# Altium project AD603.PrjPCB
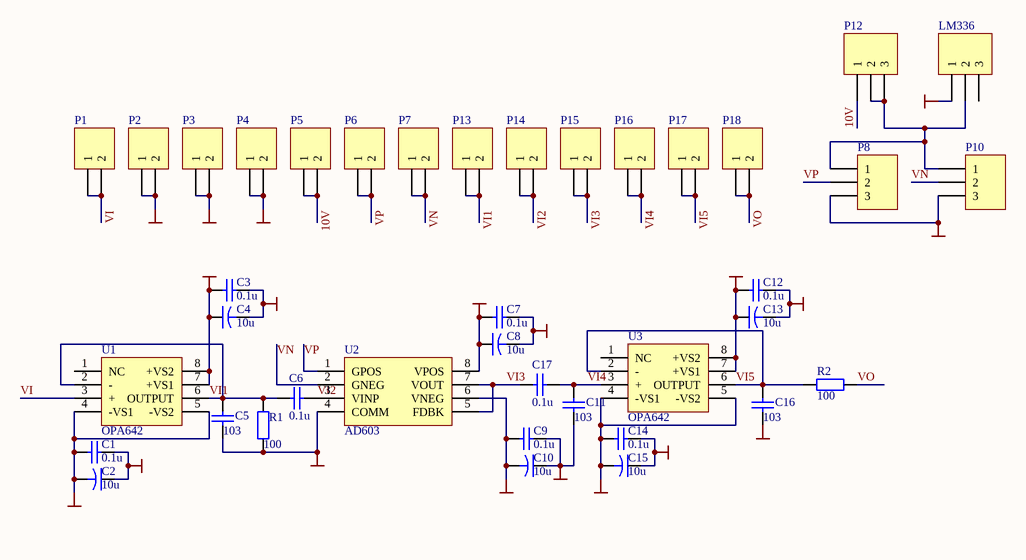
[diagram p0: AD603.SchDoc]
2 sheets, 97 parts. Net scope: global (net labels, ports and power ports of the same name join across sheets).
Board file: AD603.PcbDoc
Sheets:
  AD603.SchDoc
  TLC5510.SchDoc

## Sheet AD603.SchDoc
size A4

### Parts
(Parts that share a designator on the sheet are numbered #1, #2 ... from top to bottom, then left to right.)
C1#1  value 0.1u  [CC2012-0805]
C2#1  value 10u  [CR3225-1210]
C3#1  value 0.1u  [CR3225-1210]
C4#1  value 10u  [CC2012-0805]
C5#1  value 103  [CC2012-0805]
C6#1  value 0.1u  [CC2012-0805]
C7#1  value 0.1u  [CR3225-1210]
C8#1  value 10u  [CC2012-0805]
C9#1  value 0.1u  [CR3225-1210]
C10#1  value 10u  [CC2012-0805]
C11#1  value 103  [CC2012-0805]
C12#1  value 0.1u  [CC3216-1206]
C13#1  value 10u  [CC2012-0805]
C14#1  value 0.1u  [CC2012-0805]
C15#1  value 10u  [CR3225-1210]
C16#1  value 103  [CC2012-0805]
C17#1  value 0.1u  [CC2012-0805]
LM336#1  (no value)  [HDR1X3]
P1  (no value)  [HDR1X2]
P2  (no value)  [HDR1X2]
P3  (no value)  [HDR1X2]
P4  (no value)  [HDR1X2]
P5  (no value)  [HDR1X2]
P6  (no value)  [HDR1X2]
P7  (no value)  [HDR1X2]
P8  (no value)  [HDR1X3]
P10  (no value)  [HDR1X3]
P12  (no value)  [HDR1X3]
P13  (no value)  [HDR1X2]
P14  (no value)  [HDR1X2]
P15  (no value)  [HDR1X2]
P16  (no value)  [HDR1X2]
P17  (no value)  [HDR1X2]
P18  (no value)  [HDR1X2]
R1#1  value 100  [CC3216-1206]
R2#1  value 100  [CC3216-1206]
U1#1  OPA642  [DIP-8]
U2#1  AD603  [SO-8]
U3#1  OPA642  [DIP-8]

### Nets
GND: C1#1.1 C2#1.1 C3#1.2 C4#1.2 C5#1.1 C7#1.2 C8#1.2 C9#1.1 C10#1.1 C11#1.1 C12#1.2 C13#1.2 C14#1.1 C15#1.1 C16#1.1 LM336#1.1 P4.1 P4.2 P8.3 P10.3 R1#1.2 U2#1.4(COMM)
VCC: C3#1.1 C4#1.1 C7#1.1 C8#1.1 C12#1.1 C13#1.1 P3.1 P3.2 U1#1.7(+VS1) U1#1.8(+VS2) U2#1.8(VPOS) U3#1.7(+VS1) U3#1.8(+VS2)
VEE: C1#1.2 C2#1.2 C9#1.2 C10#1.2 C14#1.2 C15#1.2 P2.1 P2.2 U1#1.4(-VS1) U1#1.5(-VS2) U2#1.6(VNEG) U3#1.4(-VS1) U3#1.5(-VS2)
10V: P5.1 P5.2 P12.1
VI: P1.1 P1.2 U1#1.3(+)
VI1: C5#1.2 C6#1.1 P13.1 P13.2 R1#1.1 U1#1.2(-) U1#1.6(OUTPUT)
VI2: C6#1.2 P14.1 P14.2 U2#1.3(VINP)
VI3: C17#1.1 P15.1 P15.2 U2#1.5(FDBK) U2#1.7(VOUT)
VI4: C11#1.2 C17#1.2 P16.1 P16.2 U3#1.3(+)
VI5: C16#1.2 P17.1 P17.2 R2#1.1 U3#1.2(-) U3#1.6(OUTPUT)
VN: P7.1 P7.2 P10.2 U2#1.2(GNEG)
VO: P18.1 P18.2 R2#1.2
VP: P6.1 P6.2 P8.2 U2#1.1(GPOS)
NetLM336#1_2: LM336#1.2 P8.1 P10.1 P12.2 P12.3

Not connected (* = marked no-connect by the designer): LM336#1 3; U1#1 1(NC); U3#1 1(NC)

### Library data of the parts
C1#1 C3#1 C6#1 C7#1 C9#1 C12#1 C14#1 C17#1 = Cap Semi: Capacitor (Semiconductor SIM Model); Published: 8-Jun-2000; LatestRevisionDate: 17-Jul-2002; LatestRevisionNote: Re-released for DXP Platform.; PackageReference: C1206; Publisher: Altium Limited
C2#1 C4#1 C8#1 C10#1 C13#1 C15#1 = Cap2: Capacitor; Published: 23-Sep-2002; Publisher: Altium Limited
C5#1 C11#1 C16#1 = Cap: Capacitor; Published: 8-Jun-2000; LatestRevisionDate: 17-Jul-2002; LatestRevisionNote: Re-released for DXP Platform.; Publisher: Altium Limited
LM336#1 P8 P10 P12 = Header 3: Header, 3-Pin; LatestRevisionDate: 17-Jul-2002; LatestRevisionNote: Re-released for DXP Platform.; Publisher: Altium Limited
P1-P7 = Header 2: Header, 2-Pin; LatestRevisionDate: 17-Jul-2002; LatestRevisionNote: Re-released for DXP Platform.; Publisher: Altium Limited
P13-P18 = Header 2H: Header, 2-Pin, Right Angle; LatestRevisionDate: 17-Jul-2002; LatestRevisionNote: Re-released for DXP Platform.; Publisher: Altium Limited
R1#1 R2#1 = Res2: Resistor; Published: 8-Jun-2000; LatestRevisionDate: 17-Jul-2002; LatestRevisionNote: Re-released for DXP Platform.; Publisher: Altium Limited

## Sheet TLC5510.SchDoc
size A4
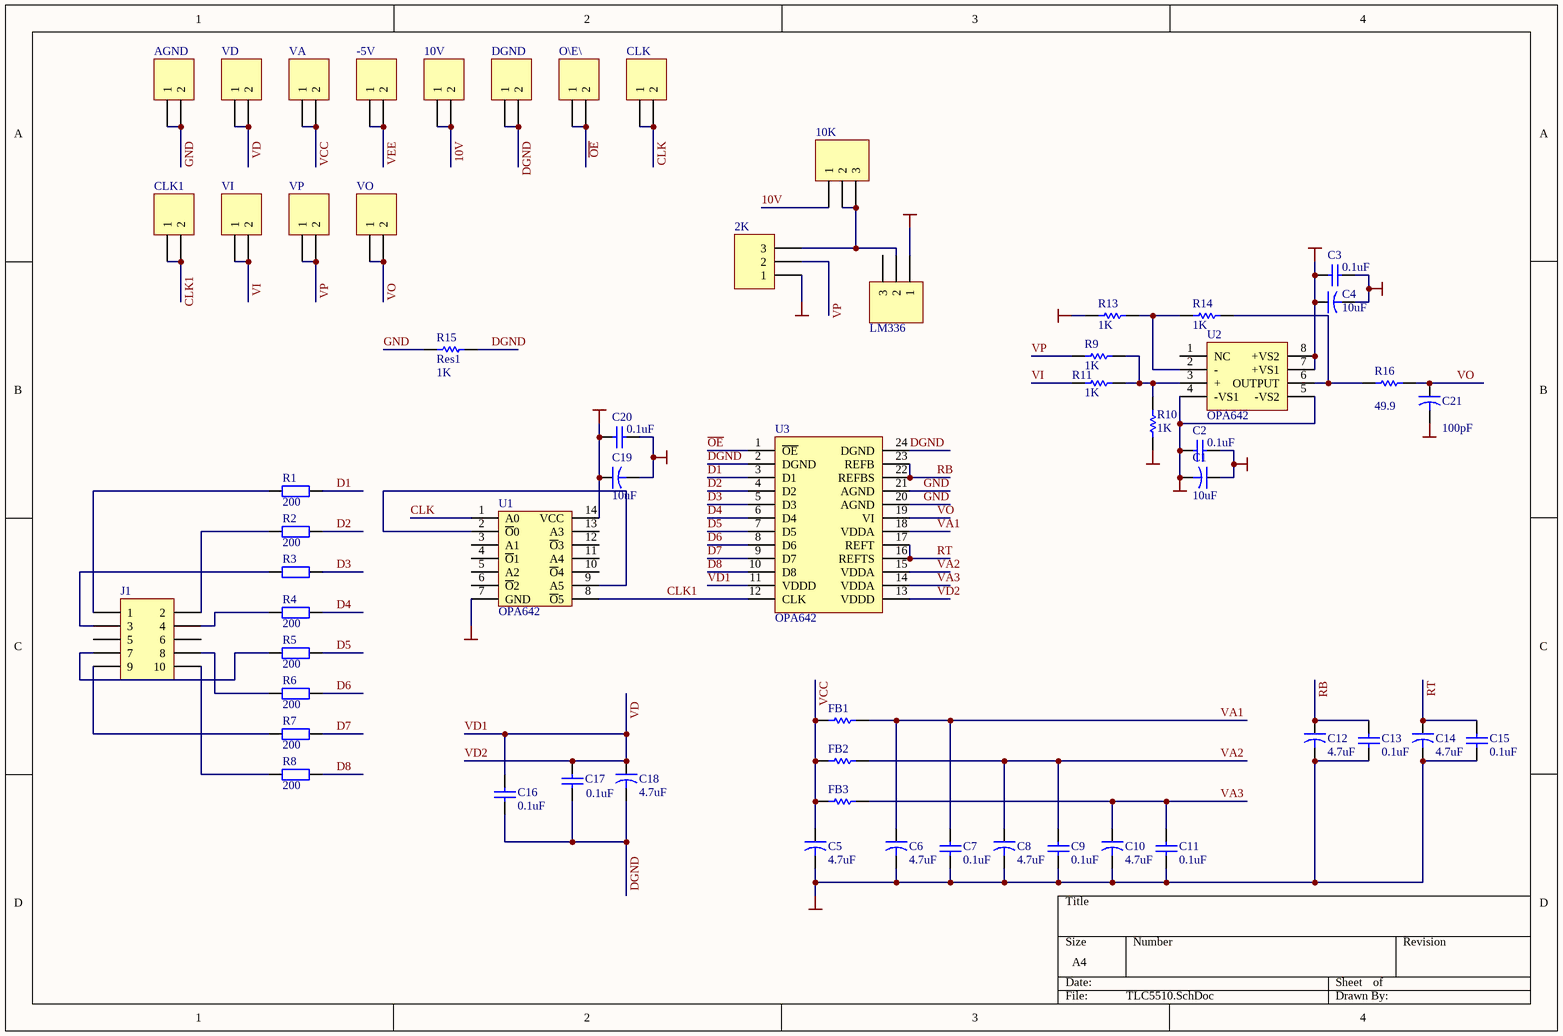
[diagram p1: TLC5510.SchDoc]

### Parts
(Parts that share a designator on the sheet are numbered #1, #2 ... from top to bottom, then left to right.)
2K  (no value)  [HDR1X3]
10K  (no value)  [HDR1X3]
10V  (no value)  [HDR1X2]
-5V  (no value)  [HDR1X2]
AGND  (no value)  [HDR1X2]
C1#2  value 10uF  [CR3225-1210]
C2#2  value 0.1uF  [CC2012-0805]
C3#2  value 0.1uF  [CC2012-0805]
C4#2  value 10uF  [CR3225-1210]
C5#2  value 4.7uF  [CR3225-1210]
C6#2  value 4.7uF  [CR3225-1210]
C7#2  value 0.1uF  [CC2012-0805]
C8#2  value 4.7uF  [CR3225-1210]
C9#2  value 0.1uF  [CC2012-0805]
C10#2  value 4.7uF  [CR3225-1210]
C11#2  value 0.1uF  [CC2012-0805]
C12#2  value 4.7uF  [CR3225-1210]
C13#2  value 0.1uF  [CC2012-0805]
C14#2  value 4.7uF  [CR3225-1210]
C15#2  value 0.1uF  [CC2012-0805]
C16#2  value 0.1uF  [CC2012-0805]
C17#2  value 0.1uF  [CC2012-0805]
C18  value 4.7uF  [CR3225-1210]
C19  value 10uF  [CR3225-1210]
C20  value 0.1uF  [CC2012-0805]
C21  value 100pF  [CR3216-1206]
CLK  (no value)  [HDR1X2]
CLK1  (no value)  [HDR1X2]
DGND  (no value)  [HDR1X2]
FB1  (no value)  [CC2012-0805]
FB2  (no value)  [CC2012-0805]
FB3  (no value)  [CC2012-0805]
J1  (no value)  [HDR2X5]
LM336#2  (no value)  [HDR1X3]
O\E\  (no value)  [HDR1X2]
R1#2  value 200  [CC2012-0805]
R2#2  value 200  [CC2012-0805]
R3  (no value)  [CC2012-0805]
R4  value 200  [CC2012-0805]
R5  value 200  [CC2012-0805]
R6  value 200  [CR2012-0805]
R7  value 200  [CC2012-0805]
R8  value 200  [CC2012-0805]
R9  value 1K  [AXIAL-0.3]  (hidden comment: Res1)
R10  value 1K  [AXIAL-0.3]  (hidden comment: Res1)
R11  value 1K  [AXIAL-0.3]  (hidden comment: Res1)
R13  value 1K  [AXIAL-0.3]  (hidden comment: Res1)
R14  value 1K  [AXIAL-0.3]  (hidden comment: Res1)
R15  Res1  value 1K  [CR2012-0805]
R16  value 49.9  [CC2012-0805]
U1#2  OPA642  [SOP-14]
U2#2  OPA642  [DIP-8]
U3#2  OPA642  [SOP-24 - duplicate3]
VA  (no value)  [HDR1X2]
VD  (no value)  [HDR1X2]
VI  (no value)  [HDR1X2]
VO  (no value)  [HDR1X2]
VP  (no value)  [HDR1X2]

### Nets
GND: 2K.1 AGND.1 AGND.2 C1#2.1 C2#2.2 C3#2.2 C4#2.2 C5#2.2 C6#2.2 C7#2.1 C8#2.2 C9#2.1 C10#2.2 C11#2.1 C12#2.2 C13#2.1 C14#2.2 C15#2.1 C19.2 C20.1 C21.2 LM336#2.1 R10.1 R13.1 R15.1 U1#2.7(GND) U3#2.20(AGND) U3#2.21(AGND)
VCC: C3#2.1 C4#2.1 C5#2.1 C19.1 C20.2 FB1.2 FB2.2 FB3.2 U1#2.14(VCC) U2#2.7(+VS1) U2#2.8(+VS2) VA.1 VA.2
VEE: -5V.1 -5V.2 C1#2.2 C2#2.1 U2#2.4(-VS1) U2#2.5(-VS2)
10V: 10K.1 10V.1 10V.2
CLK: CLK.1 CLK.2 U1#2.1(A0)
CLK1: CLK1.1 CLK1.2 U1#2.8(~{O}5) U3#2.12(CLK)
D1: R1#2.2 U3#2.3(D1)
D2: R2#2.2 U3#2.4(D2)
D3: R3.2 U3#2.5(D3)
D4: R4.2 U3#2.6(D4)
D5: R5.2 U3#2.7(D5)
D6: R6.2 U3#2.8(D6)
D7: R7.2 U3#2.9(D7)
D8: R8.2 U3#2.10(D8)
DGND: C16#2.1 C17#2.1 C18.2 DGND.1 DGND.2 R15.2 U3#2.2(DGND) U3#2.24(DGND)
~{OE}: O\E\.1 O\E\.2 U3#2.1(~{OE})
RB: C12#2.1 C13#2.2 U3#2.22(REFBS) U3#2.23(REFB)
RT: C14#2.1 C15#2.2 U3#2.16(REFTS) U3#2.17(REFT)
VA1: C6#2.1 C7#2.2 FB1.1 U3#2.18(VDDA)
VA2: C8#2.1 C9#2.2 FB2.1 U3#2.15(VDDA)
VA3: C10#2.1 C11#2.2 FB3.1 U3#2.14(VDDA)
VD: C16#2.2 C17#2.2 C18.1 U3#2.11(VDDD) U3#2.13(VDDD) VD.1 VD.2  [also labelled VD1, VD2]
VI: R11.1 VI.1 VI.2
VO: C21.1 R16.2 U3#2.19(VI) VO.1 VO.2
VP: 2K.2 R9.1 VP.1 VP.2
Net2K_3: 2K.3 10K.2 10K.3 LM336#2.2
NetJ1_1: J1.1 R1#2.1
NetJ1_2: J1.2 R2#2.1
NetJ1_3: J1.3 R3.1
NetJ1_4: J1.4 R4.1
NetJ1_7: J1.7 R5.1
NetJ1_8: J1.8 R6.1
NetJ1_9: J1.9 R7.1
NetJ1_10: J1.10 R8.1
NetR9_2: R9.2 R10.2 R11.2 U2#2.3(+)
NetR13_2: R13.2 R14.2 U2#2.2(-)
NetR14_1: R14.1 R16.1 U2#2.6(OUTPUT)
NetU1#2_2: U1#2.2(~{O}0) U1#2.9(A5)

Not connected (* = marked no-connect by the designer): J1 5 6; LM336#2 3; U1#2 3(A1) 4(~{O}1) 5(A2) 6(~{O}2) 10(~{O}4) 11(A4) 12(~{O}3) 13(A3); U2#2 1(NC)

### Library data of the parts
2K 10K LM336#2 = Header 3: Header, 3-Pin; LatestRevisionDate: 17-Jul-2002; LatestRevisionNote: Re-released for DXP Platform.; Publisher: Altium Limited
10V -5V AGND CLK CLK1 DGND O\E\ VA VD VI VO VP = Header 2: Header, 2-Pin; LatestRevisionDate: 17-Jul-2002; LatestRevisionNote: Re-released for DXP Platform.; Publisher: Altium Limited
C1#2 C4#2 C5#2 C6#2 C8#2 C10#2 C12#2 C14#2 C18 C19 C21 = Cap2: Capacitor; Published: 23-Sep-2002; Publisher: Altium Limited
C2#2 C3#2 C7#2 C9#2 C11#2 C13#2 C15#2 C16#2 C17#2 C20 = Cap: Capacitor; Published: 8-Jun-2000; LatestRevisionDate: 17-Jul-2002; LatestRevisionNote: Re-released for DXP Platform.; Publisher: Altium Limited
FB1-FB3 R9-R11 R13-R16 = Res1: Resistor; Published: 8-Jun-2000; LatestRevisionDate: 17-Jul-2002; LatestRevisionNote: Re-released for DXP Platform.; Publisher: Altium Limited
J1 = Header 5X2: Header, 5-Pin, Dual row; LatestRevisionDate: 17-Jul-2002; LatestRevisionNote: Re-released for DXP Platform.; Publisher: Altium Limited
R1#2 R2#2 R4-R8 = Res2: Resistor; Published: 8-Jun-2000; LatestRevisionDate: 17-Jul-2002; LatestRevisionNote: Re-released for DXP Platform.; Publisher: Altium Limited
R3 = Res2: Resistor; Value: 200; Published: 8-Jun-2000; LatestRevisionDate: 17-Jul-2002; LatestRevisionNote: Re-released for DXP Platform.; Publisher: Altium Limited
U1#2 = 74ACT04
U3#2 = TLC5510

## Nets that join several sheets
GND: AD603 (22 pins), TLC5510 (28 pins)
VCC: AD603 (13 pins), TLC5510 (13 pins)
VEE: AD603 (13 pins), TLC5510 (6 pins)
10V: AD603 (P5.1 P5.2 P12.1), TLC5510 (10K.1 10V.1 10V.2)
VI: AD603 (P1.1 P1.2 U1#1.3), TLC5510 (R11.1 VI.1 VI.2)
VO: AD603 (P18.1 P18.2 R2#1.2), TLC5510 (5 pins)
VP: AD603 (P6.1 P6.2 P8.2 U2#1.1), TLC5510 (2K.2 R9.1 VP.1 VP.2)